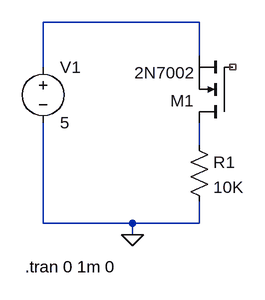
[diagram p0: schematic BodyDiode.asc]
BodyDiode.asc, the LTspice schematic file:
Version 4
SHEET 1 880 680
WIRE 208 -16 -16 -16
WIRE 208 32 208 -16
WIRE -16 48 -16 -16
WIRE 208 160 208 128
WIRE -16 272 -16 128
WIRE 112 272 -16 272
WIRE 208 272 208 240
WIRE 208 272 112 272
WIRE 112 288 112 272
FLAG 112 288 0
SYMBOL nmos 256 128 R180
SYMATTR InstName M1
SYMATTR Value 2N7002
SYMBOL voltage -16 32 R0
WINDOW 123 0 0 Left 0
WINDOW 39 0 0 Left 0
SYMATTR InstName V1
SYMATTR Value 5
SYMBOL res 192 144 R0
SYMATTR InstName R1
SYMATTR Value 10K
TEXT -42 334 Left 2 !.tran 0 1m 0

The netlist it stands for:
* BodyDiode.asc
M1 N002 NC_01 N001 N001 2N7002
V1 N001 0 5
R1 N002 0 10K
.model NMOS NMOS
.model PMOS PMOS
.lib standard.mos
.tran 0 1m 0
.backanno
.end